# EAGLE design Day0_UmarAlFaruqi_13215057 (EAGLE 7.5.0)
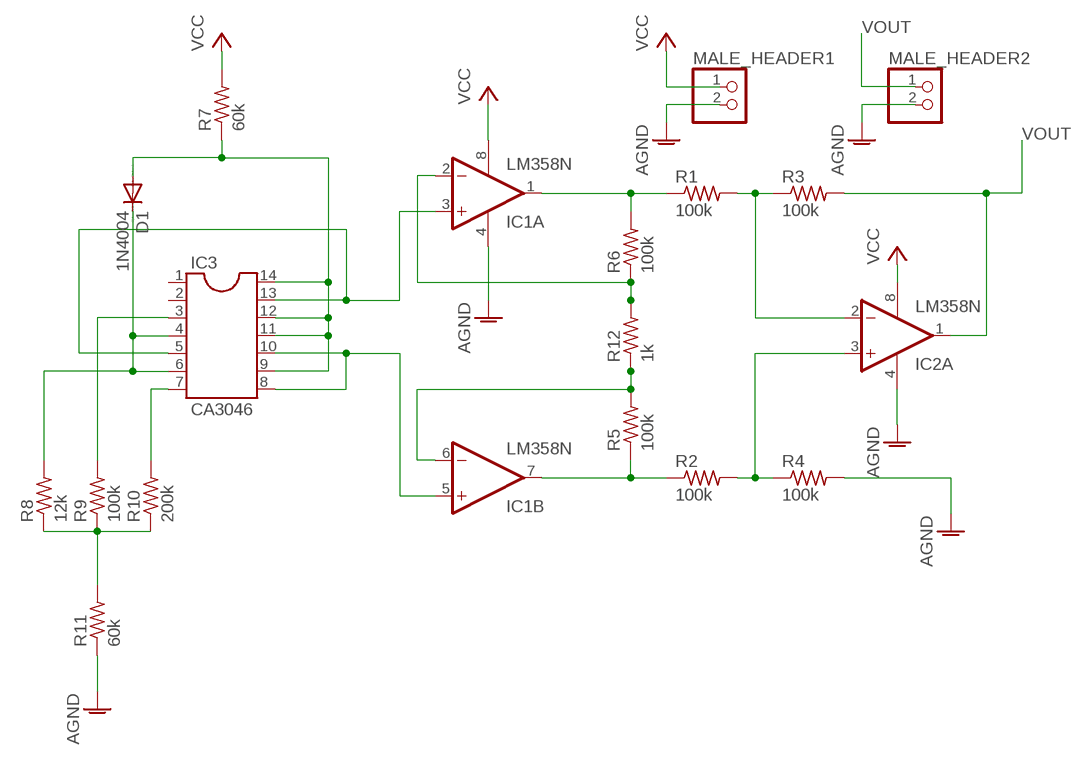
[diagram p0: schematic, sheet 1]

## Parts
D1  1N4004  [DO41-10]
IC1  LM358N  [DIL08]
IC2  LM358N  [DIL08]
IC3  CA3046  DIL14  [DIL14]
MALE_HEADER1  PINHD-1X2  [1X02]
MALE_HEADER2  PINHD-1X2  [1X02]
R1  100k  R-US_0204/2V  [0204V]
R2  100k  R-US_0204/2V  [0204V]
R3  100k  R-US_0204/2V  [0204V]
R4  100k  R-US_0204/2V  [0204V]
R5  100k  R-US_0204/2V  [0204V]
R6  100k  R-US_0204/2V  [0204V]
R7  60k  R-US_0204/2V  [0204V]
R8  12k  R-US_0204/2V  [0204V]
R9  100k  R-US_0204/2V  [0204V]
R10  200k  R-US_0204/2V  [0204V]
R11  60k  R-US_0204/2V  [0204V]
R12  1k  R-US_0204/2V  [0204V]

## Nets
AGND: IC1.4(P:V-) IC2.4(P:V-) MALE_HEADER1.2 MALE_HEADER2.2 R4.2 R11.1
N$1: D1.A IC3.9 IC3.11 IC3.12 IC3.14 R7.1
N$2: D1.C IC3.4 IC3.6 R8.2
N$3: IC3.7 R10.2
N$4: IC3.3 R9.2
N$5: IC1.3(A:+IN) IC3.5 IC3.13
N$6: IC1.5(B:+IN) IC3.8 IC3.10
N$7: R8.1 R9.1 R10.1 R11.2
N$8: IC1.2(A:-IN) R6.1 R12.2
N$9: IC1.1(A:OUT) R1.1 R6.2
N$10: IC2.2(A:-IN) R1.2 R3.1
N$11: IC1.6(B:-IN) R5.2 R12.1
N$13: IC1.7(B:OUT) R2.1 R5.1
N$14: IC2.3(A:+IN) R2.2 R4.1
VCC: IC1.8(P:V+) IC2.8(P:V+) MALE_HEADER1.1 R7.2
VOUT: IC2.1(A:OUT) MALE_HEADER2.1 R3.2
Unconnected: IC2.5(B:+IN) IC2.6(B:-IN) IC2.7(B:OUT) IC3.1 IC3.2

## Library data of the parts
D1 = diode:1N4004: DIODE general purpose rectifier, 1 A
IC1 IC2 = linear:LM358: OP AMP also LM158; LM258; LM2904 Source: http://cache.national.com/ds/LM/LM158.pdf
IC3 = ic-package:DIL14: Dual In Line / Socket
MALE_HEADER1 MALE_HEADER2 = pinhead:PINHD-1X2: PIN HEADER
R1-R12 = rcl:R-US_: RESISTOR, American symbol

## Board
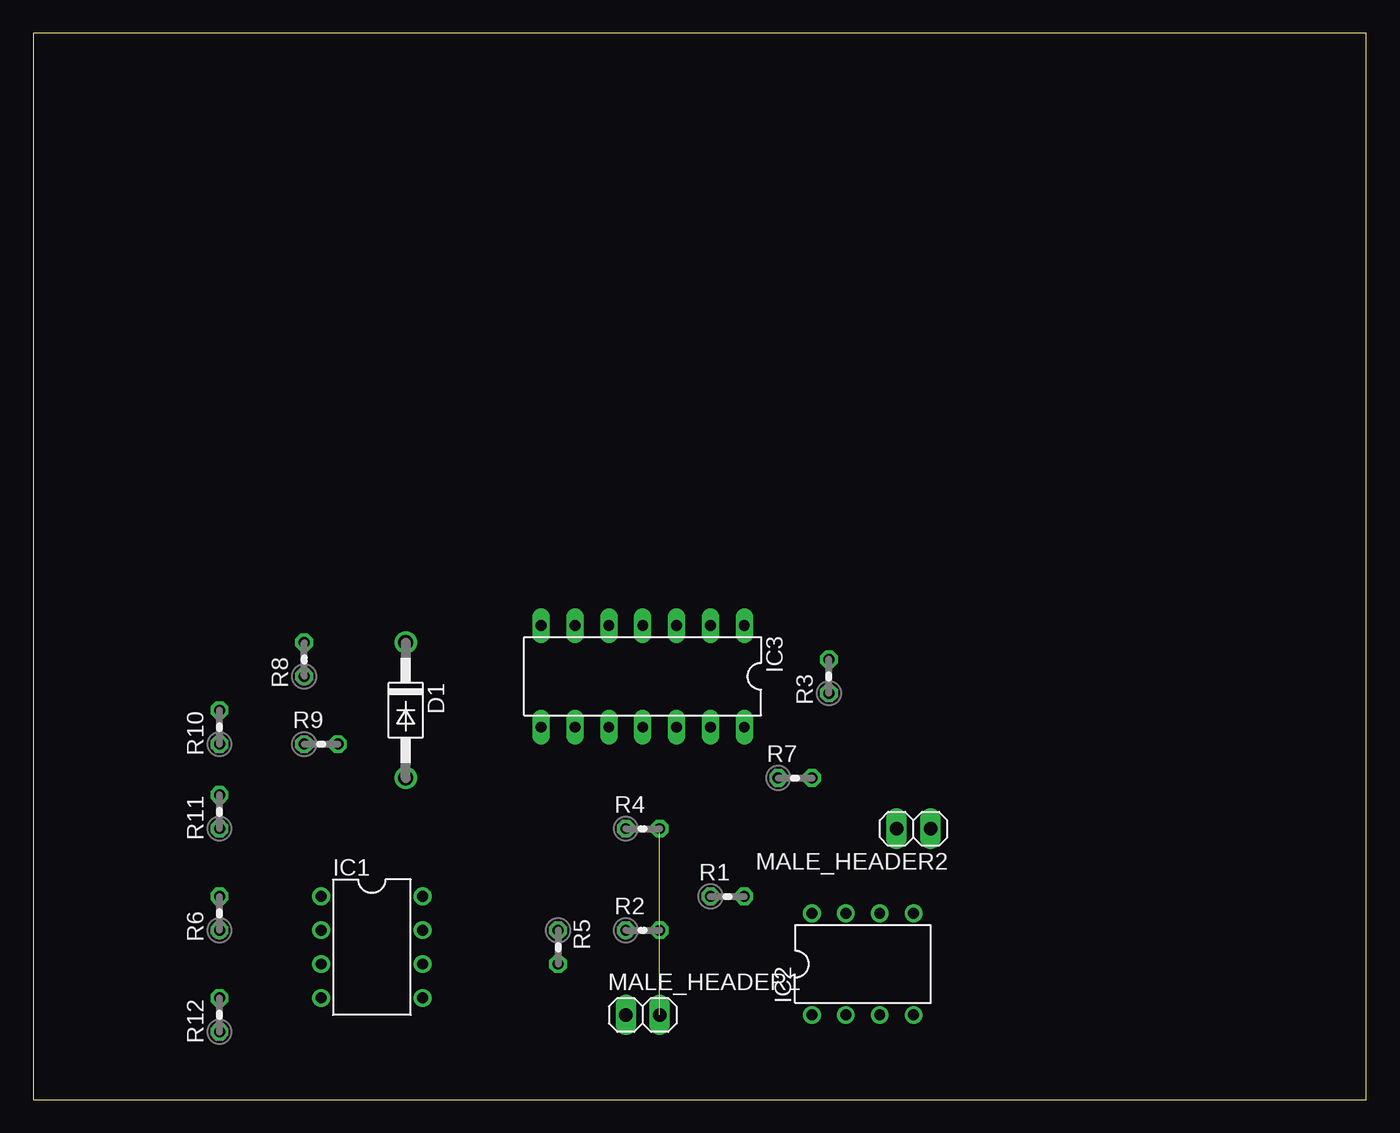
[diagram p1: board, top side]
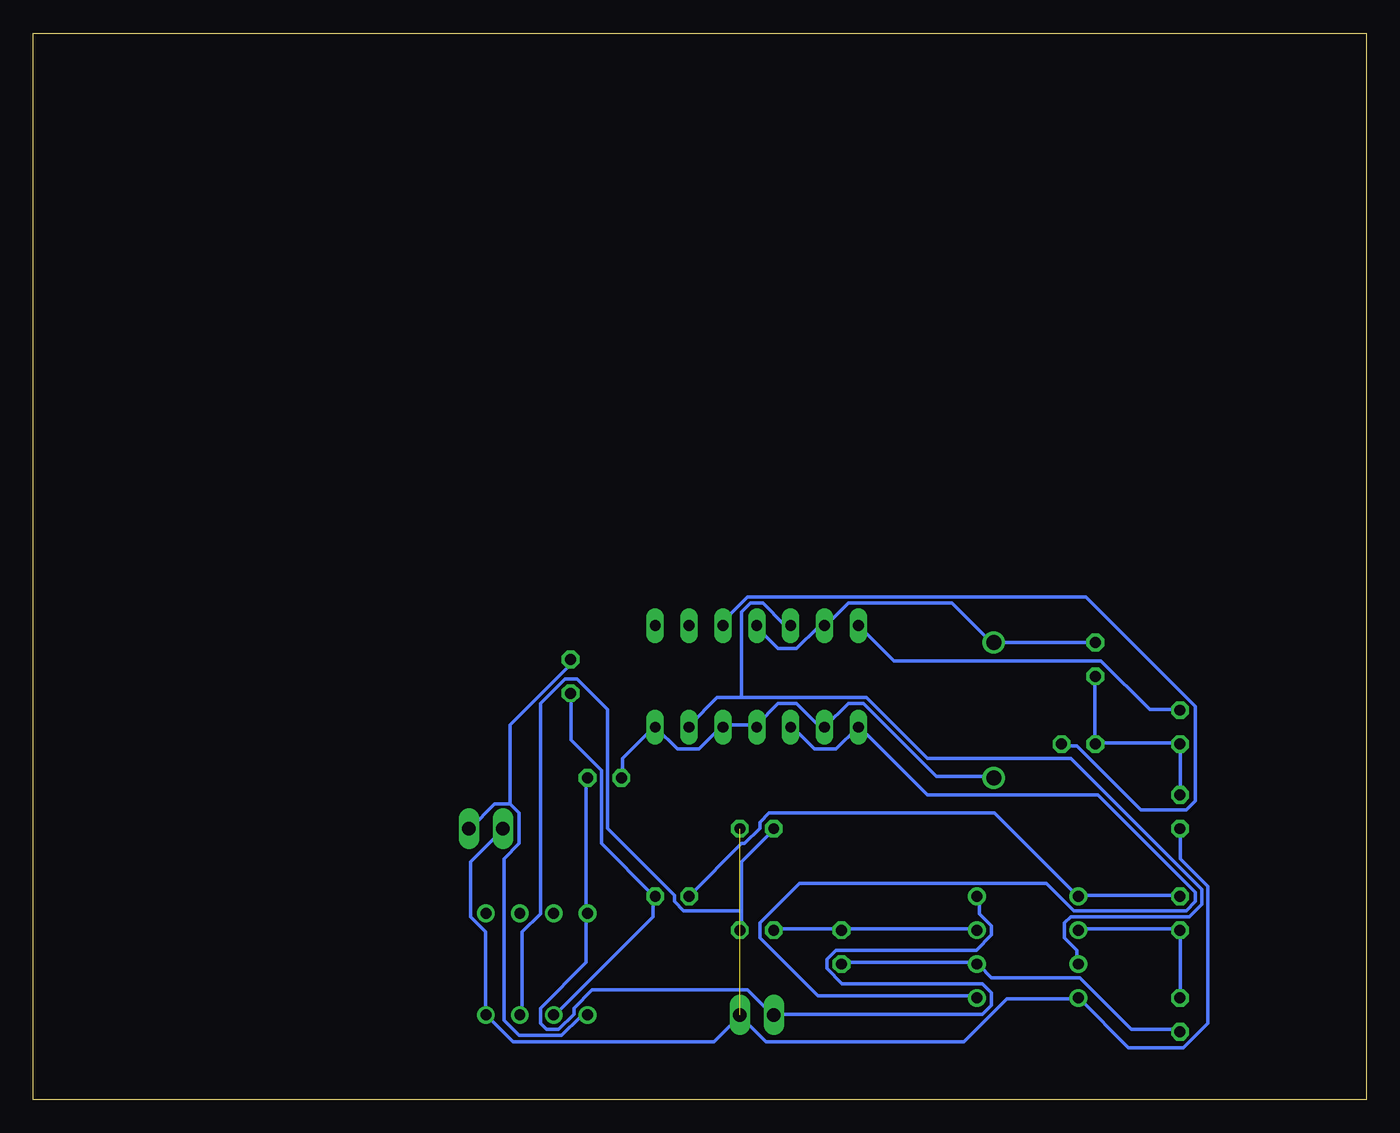
[diagram p2: board, bottom side, seen from below]

Size 100 x 80 mm. Coordinates in mm from the lower left corner, seen from the top.
Outline: 0,0 100,0 100,80 0,80 0,0
Copper layers (1*16): Top 0.035mm / dielectric 1.5mm / Bottom 0.035mm
Design rules "default": minimum track width 10mil, minimum drill 24mil, track to track 8mil, track to pad 8mil, pad to pad 8mil, via to via 8mil, smd to smd 8mil, copper to edge 40mil, drill to drill 8mil, minimum pad ring 10mil, minimum via ring 8mil, stop-mask expansion 4mil, vias tented up to drill 0mil, thermal gap 10mil

### Footprints (pad centres in the part's own frame; a part is rotated, then mirrored left to right if it is on the bottom)
DO41-10 = drill 1.118: A 5.08,0; C -5.08,0
DIL08 = drill 0.813 pad 1.27: 1 -3.81,-3.81; 2 -1.27,-3.81; 3 1.27,-3.81; 4 3.81,-3.81; 5 3.81,3.81; 6 1.27,3.81; 7 -1.27,3.81; 8 -3.81,3.81
DIL14 = drill 0.813 long: 1 -7.62,-3.81; 2 -5.08,-3.81; 3 -2.54,-3.81; 4 0,-3.81; 5 2.54,-3.81; 6 5.08,-3.81; 7 7.62,-3.81; 8 7.62,3.81; 9 5.08,3.81; 10 2.54,3.81; 11 0,3.81; 12 -2.54,3.81; 13 -5.08,3.81; 14 -7.62,3.81
1X02 = drill 1.016 long: 1 -1.27,0; 2 1.27,0
0204V = drill 0.813 octagon: 1 -1.27,0; 2 1.27,0

### Placement (x,y rotation side)
D1  27.94,29.21 270 top
IC1  25.4,11.43 270 top
IC2  62.23,10.16 0 top
IC3  45.72,31.75 180 top
MALE_HEADER1  45.72,6.35 0 top
MALE_HEADER2  66.04,20.32 180 top
R1  52.07,15.24 0 top
R2  45.72,12.7 0 top
R3  59.69,31.75 90 top
R4  45.72,20.32 0 top
R5  39.37,11.43 270 top
R6  13.97,13.97 90 top
R7  57.15,24.13 0 top
R8  20.32,33.02 90 top
R9  21.59,26.67 0 top
R10  13.97,27.94 90 top
R11  13.97,21.59 90 top
R12  13.97,6.35 90 top

### Tracks (layer width: path | path; a pad name or v marks a point on that pad's centre or on a via)
AGND  (1 unrouted)
  Bottom 0.254: MALE_HEADER2.2 64.92,20.12 67.21,17.83 67.21,13.72 66.06,12.57 66.06,6.4 IC2.4 65.84,6.17 64.01,4.34 48.92,4.34 47.09,6.17 MALE_HEADER1.2 46.86,6.17 45.03,4.34 30.18,4.34 26.98,7.54 21.72,7.54 IC1.4 21.49,7.54 17.83,3.89 13.72,3.89 11.89,5.71 11.89,16 13.95,18.06 13.95,20.12 R11.1
N$1
  Bottom 0.254: R7.1 55.78,24.23 55.78,25.6 53.49,27.89 IC3.14 53.26,27.89 51.66,26.29 50.06,26.29 48.46,27.89 IC3.12 48.23,28.12 45.72,28.12 | 45.72,28.12 44.12,29.72 42.75,29.72 41.15,28.12 40.69,28.12 IC3.9 38.86,29.72 37.72,29.72 32.23,24.23 28.12,24.23 D1.A | 45.72,28.12 IC3.11
N$2
  Bottom 0.254: IC3.4 45.72,35.43 44.12,33.83 42.75,33.83 41.15,35.43 40.69,35.43 IC3.6 40.46,35.66 38.86,37.26 31.09,37.26 28.12,34.29 D1.C R8.2
N$3
  Bottom 0.254: R10.2 14.17,29.26 16.23,29.26 19.89,32.92 35.43,32.92 37.95,35.43 IC3.7
N$4
  Bottom 0.254: R9.2 22.86,26.52 21.72,26.52 16.92,21.72 13.49,21.72 12.8,22.4 12.8,29.49 21.03,37.72 46.41,37.72 48.46,35.66 IC3.3
N$5
  Bottom 0.254: 46.86,30.18 48.69,30.18 50.75,28.12 IC3.13 | 46.86,30.18 37.49,30.18 32.92,25.6 22.17,25.6 12.34,15.77 12.34,14.63 13.26,13.72 22.17,13.72 22.63,13.26 22.63,12.12 21.72,11.2 21.72,10.29 IC1.3 | 46.86,30.18 46.86,36.58 46.18,37.26 45.26,37.26 43.66,35.66 43.2,35.66 IC3.5
N$6
  Bottom 0.254: IC1.5 29.26,7.77 41.15,7.77 45.49,12.12 45.49,13.26 42.52,16.23 24,16.23 21.95,14.17 13.49,14.17 12.8,14.86 12.8,15.54 20.12,22.86 32.92,22.86 37.95,27.89 IC3.8 38.18,27.89 39.78,26.29 41.38,26.29 42.98,27.89 IC3.10
N$7
  Bottom 0.254: R11.2 13.95,22.86 13.95,26.52 R10.1 14.17,26.75 20.12,26.75 R9.1 20.34,26.75 20.34,31.55 R8.1
N$8
  Bottom 0.254: R12.2 13.95,7.77 13.95,12.57 R6.1 14.17,12.8 21.49,12.8 IC1.2
N$9
  Bottom 0.254: R6.2 14.17,15.32 21.49,15.32 IC1.1 21.72,15.32 27.89,21.49 44.81,21.49 45.49,20.8 45.49,20.34 46.63,19.2 46.86,19.2 50.75,15.32 R1.1
N$10
  Bottom 0.254: IC2.2 60.81,6.4 53.49,13.72 53.49,15.09 R1.2 53.49,15.32 57.38,19.2 57.38,24.69 59.66,26.98 59.66,30.4 R3.1
N$11
  Bottom 0.254: R12.1 14.17,5.26 17.6,5.26 21.49,9.14 28.12,9.14 29.03,10.06 IC1.6 29.26,10.29 39.32,10.29 R5.2
N$13
  Bottom 0.254: IC1.7 29.26,12.8 39.32,12.8 R5.1 39.55,12.8 44.35,12.8 R2.1
N$14
  Bottom 0.254: 46.86,14.17 46.86,17.83 44.58,20.12 R4.1 | 46.86,14.17 46.86,12.8 R2.2 | 46.86,14.17 51.21,14.17 51.89,14.86 51.89,15.32 56.92,20.34 56.92,29.26 59.21,31.55 60.12,31.55 61.95,29.72 61.95,13.95 63.32,12.57 63.32,6.4 IC2.3
VCC
  Bottom 0.254: R7.2 58.52,24 58.52,14.17 IC2.8 58.52,13.95 58.52,10.29 61.95,6.86 61.95,5.71 61.49,5.26 60.58,5.26 59.44,6.4 59.44,6.86 58.06,8.23 46.41,8.23 44.58,6.4 MALE_HEADER1.1 44.35,6.4 28.8,6.4 28.12,7.09 28.12,8 28.8,8.69 39.32,8.69 40.46,9.83 40.46,10.52 39.78,11.2 29.26,11.2 28.12,12.34 28.12,13.03 29.03,13.95 29.03,15.09 IC1.8
VOUT
  Bottom 0.254: 64.24,22.17 63.55,21.49 63.55,19.2 64.69,18.06 64.69,5.94 63.55,4.8 60.35,4.8 58.98,6.17 58.52,6.17 IC2.1 | 64.24,22.17 65.38,22.17 67.21,20.34 MALE_HEADER2.1 | 64.24,22.17 64.24,28.12 59.89,32.46 59.89,32.92 R3.2